# Altium schematic sheet 13.SchDoc
size 513 x 386 mm
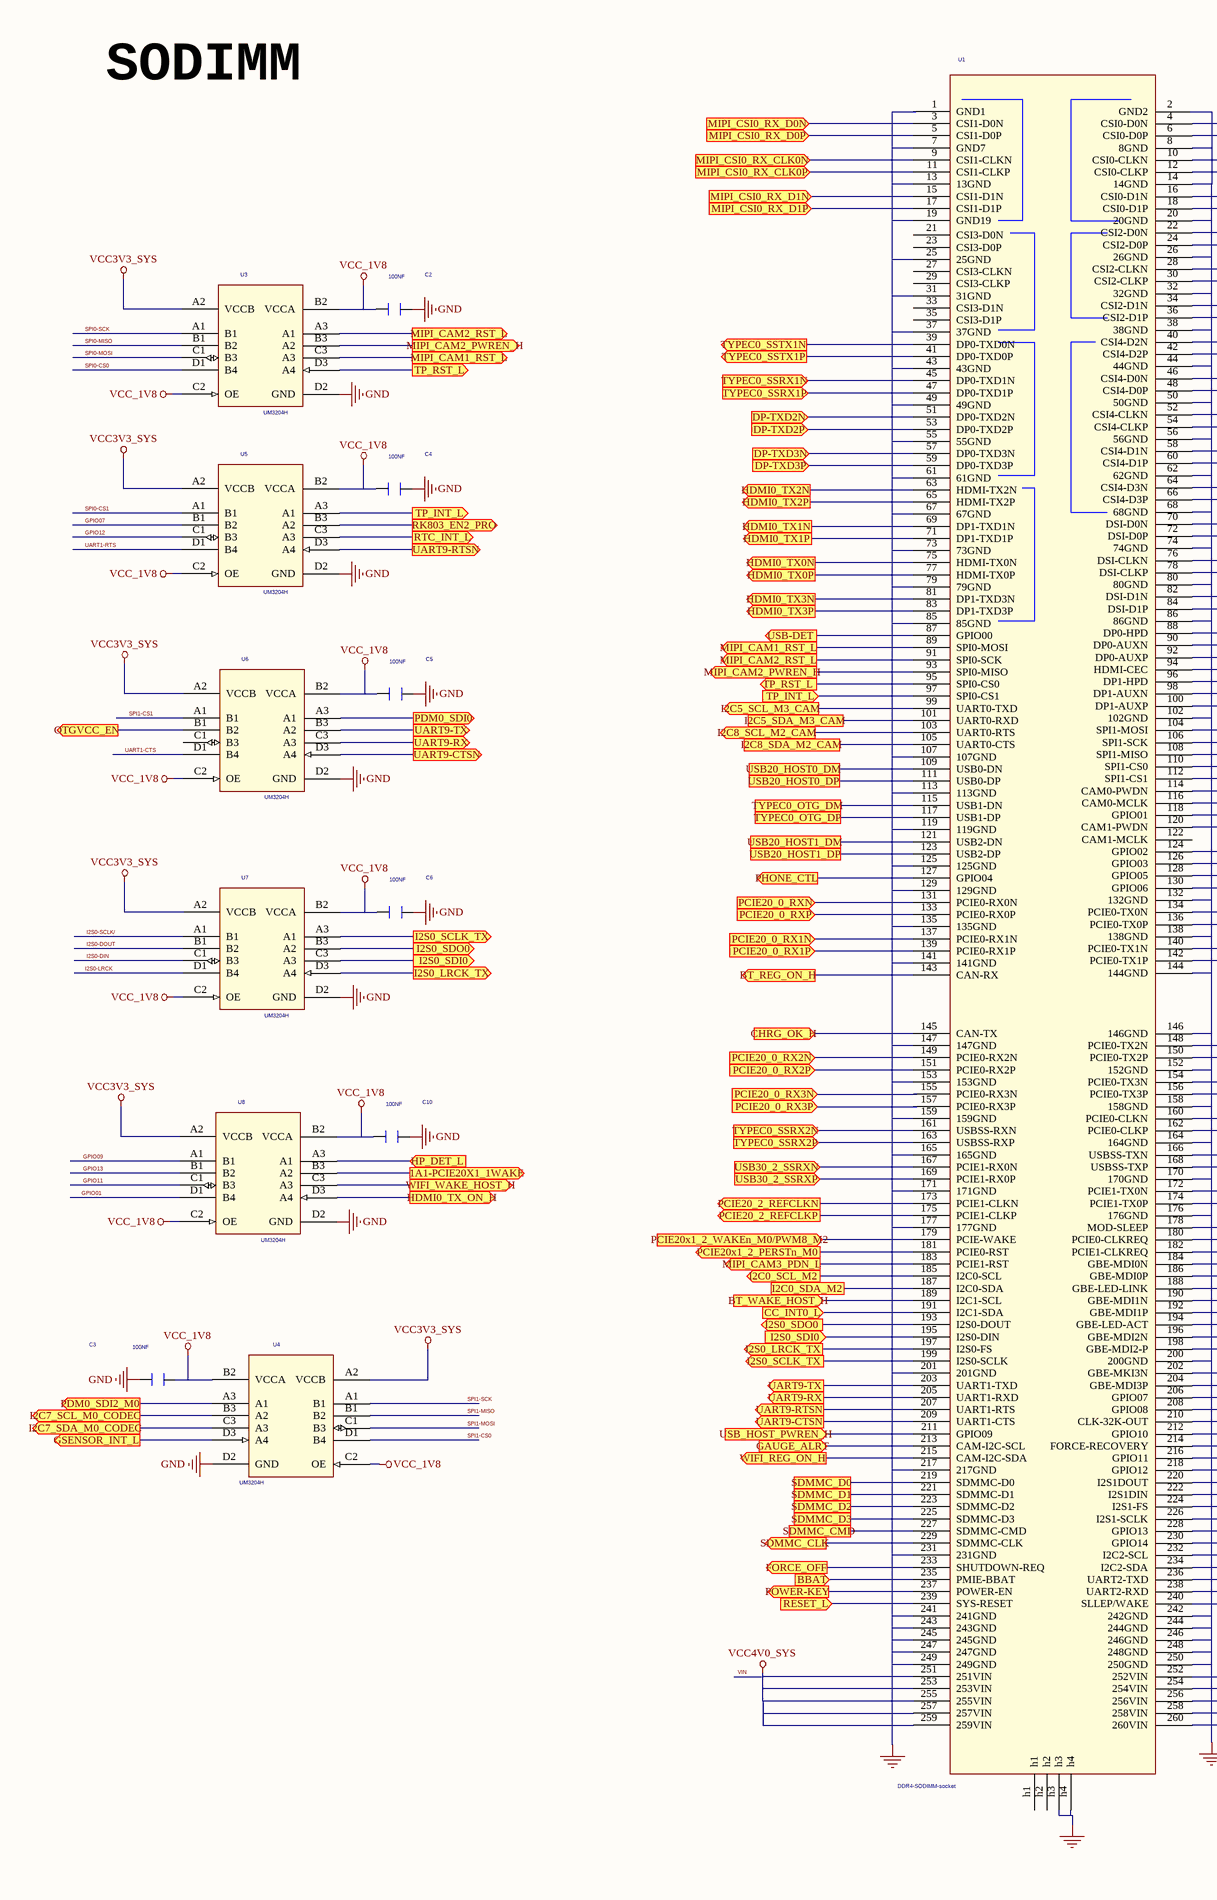
[diagram p0: 13.SchDoc, left]
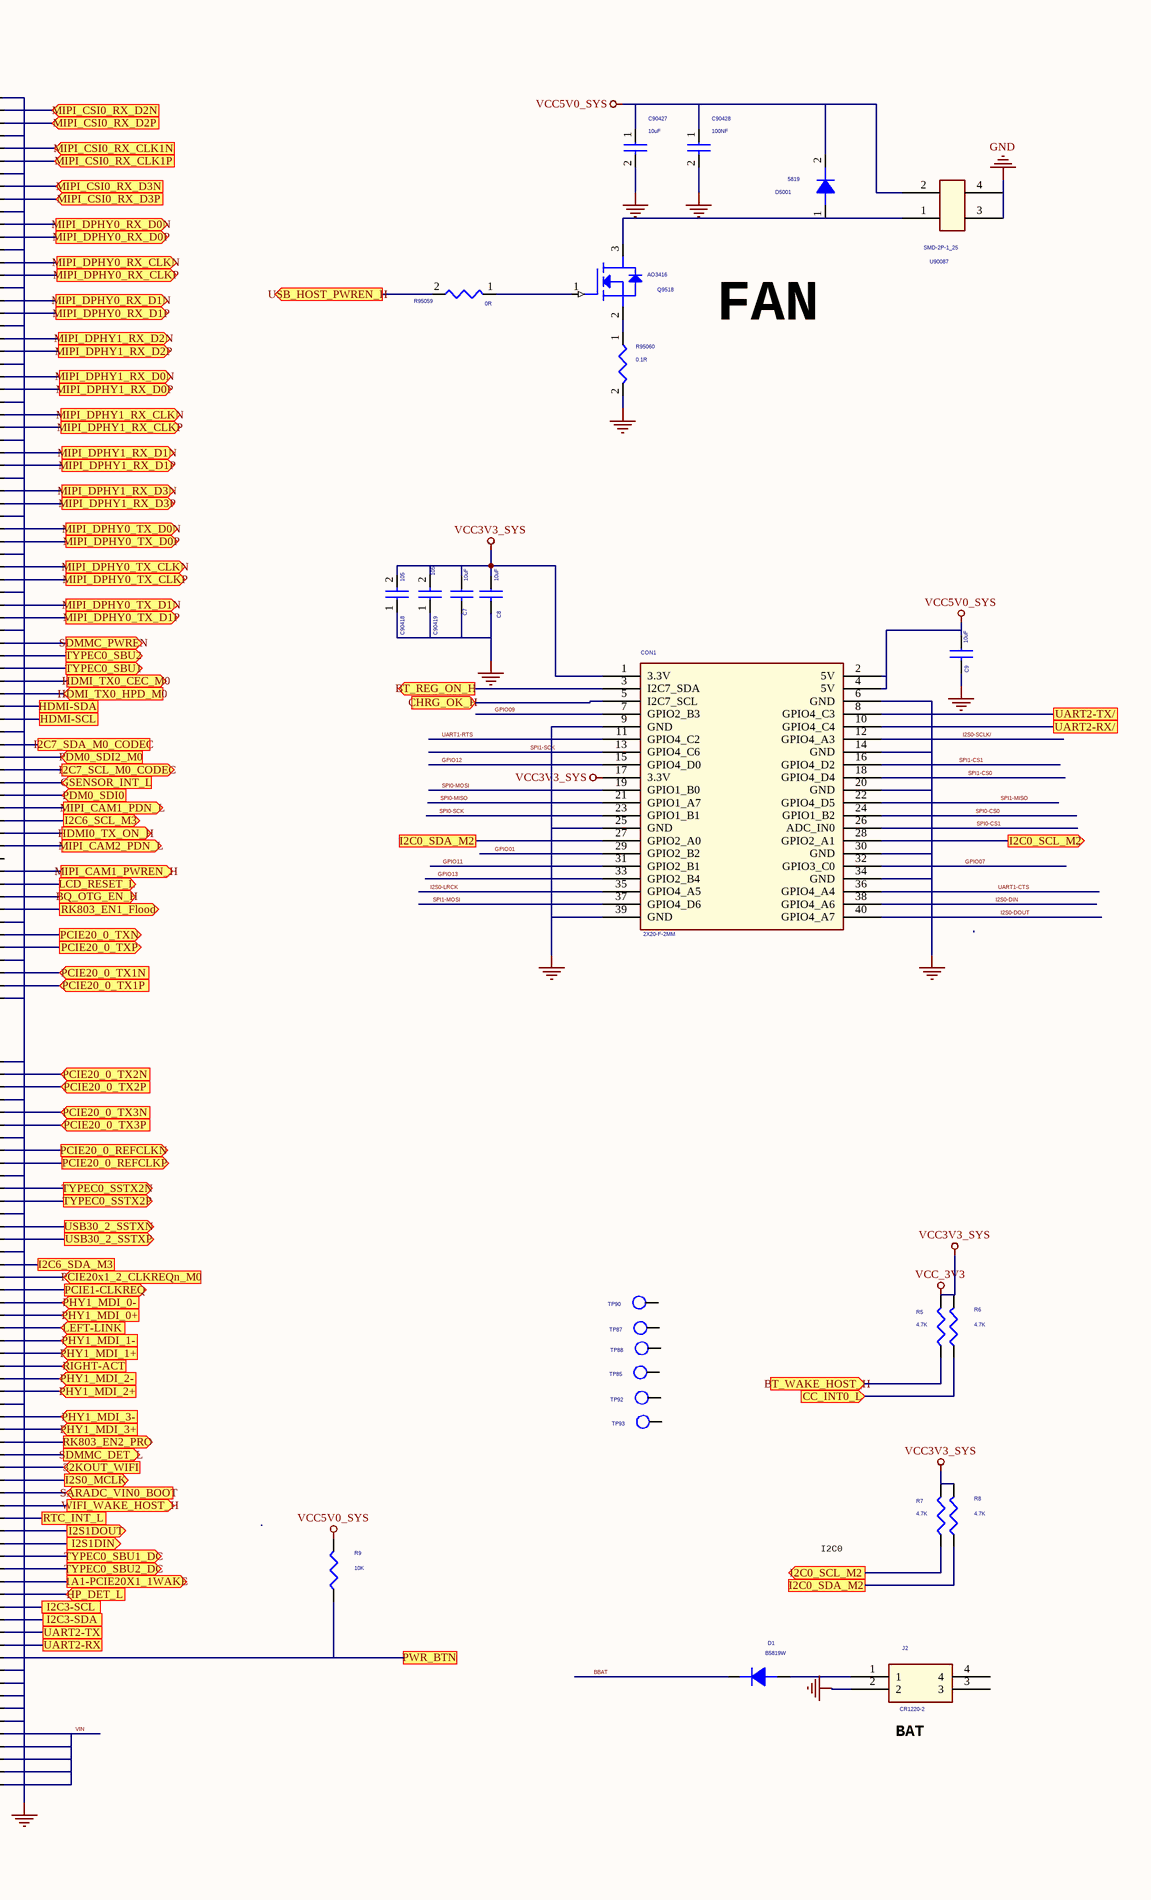
[diagram p1: 13.SchDoc, right]

## Parts
C2  100NF  [C0402]
C3  100NF  [C0402]
C4  100NF  [C0402]
C5  100NF  [C0402]
C6  100NF  [C0402]
C7  10uF  [C0603]
C8  10uF  [C0603]
C9  10uF  [C0603]
C10  100NF  [C0402]
C90418  105  [C0402]
C90419  105  [C0402]
C90427  10uF  [C1206]
C90428  100NF  [C0402]
CON1  2X20-F-2MM  [DIP40PIN-2.54MM_FX]
D1  B5819W  [SOD_123]
D5001  5819  [SOD_123]
J2  CR1220-2  [CR1220-2]
Q9518  AO3416  [SOT23]
R5  4.7K  [R0402]
R6  4.7K  [R0402]
R7  4.7K  [R0402]
R8  4.7K  [R0402]
R9  10K  [R0402]
R95059  0R  [R0402]
R95060  0.1R  [R0402]
TP85  TP  [tp1-8040]  (value not drawn)
TP87  TP  [tp1-8040]  (value not drawn)
TP88  TP  [tp1-8040]  (value not drawn)
TP90  TP  [tp1-8040]  (value not drawn)
TP92  TP  [tp1-8040]  (value not drawn)
TP93  TP  [tp1-8040]  (value not drawn)
U1  DDR4-SODIMM-socket  [DDR4-SODIMM-socket]
U3  UM3204H  [CSP-12]
U4  UM3204H  [CSP-12]
U5  UM3204H  [CSP-12]
U6  UM3204H  [CSP-12]
U7  UM3204H  [CSP-12]
U8  UM3204H  [CSP-12]
U90087  SMD-2P-1_25  [SMD-2P-1_25]

## Ports
1A1-PCIE20X1_1WAKE (out), 32KOUT_WIFI (in), BBAT (in), BQ_OTG_EN_H (out), BT_REG_ON_H (out), BT_WAKE_HOST_H (in), CC_INT0_L (in), CHRG_OK_H (in), DP-TXD2N (in), DP-TXD2P (in), DP-TXD3N (in), DP-TXD3P (in), FORCE_OFF (out), GAUGE_ALRT (in), GSENSOR_INT_L (in), GSENSOR_INT_L (out), HDMI0_TX0N (out), HDMI0_TX0P (out), HDMI0_TX1N (out), HDMI0_TX1P (out), HDMI0_TX2N (out), HDMI0_TX2P (out), HDMI0_TX3N (out), HDMI0_TX3P (out), HDMI0_TX_ON_H (out), HDMI-SCL, HDMI-SDA, HDMI_TX0_CEC_M0 (out), HDMI_TX0_HPD_M0 (in), HP_DET_L (in), I2C0_SCL_M2 (out), I2C0_SDA_M2, I2C3-SCL, I2C3-SDA, I2C5_SCL_M3_CAM (out), I2C5_SDA_M3_CAM, I2C6_SCL_M3 (out), I2C6_SDA_M3, I2C7_SCL_M0_CODEC (out), I2C7_SDA_M0_CODEC, I2C7_SDA_M0_CODEC (out), I2C8_SCL_M2_CAM (out), I2C8_SDA_M2_CAM, I2S0_LRCK_TX (out), I2S0_MCLK (out), I2S0_SCLK_TX (out), I2S0_SDI0 (in), I2S0_SDI0 (out), I2S0_SDO0 (out), I2S1DIN (out), I2S1DOUT (out), LCD_RESET_L (out), LEFT-LINK (in), MIPI_CAM1_PDN_L (out), MIPI_CAM1_PWREN_H (out), MIPI_CAM1_RST_L (out), MIPI_CAM2_PDN_L (out), MIPI_CAM2_PWREN_H (out), MIPI_CAM2_RST_L (out), MIPI_CAM3_PDN_L (out), MIPI_CSI0_RX_CLK0N (in), MIPI_CSI0_RX_CLK0P (in), MIPI_CSI0_RX_CLK1N (in), MIPI_CSI0_RX_CLK1P (in), MIPI_CSI0_RX_D0N (in), MIPI_CSI0_RX_D0P (in), MIPI_CSI0_RX_D1N (in), MIPI_CSI0_RX_D1P (in), MIPI_CSI0_RX_D2N (in), MIPI_CSI0_RX_D2P (in), MIPI_CSI0_RX_D3N (in), MIPI_CSI0_RX_D3P (in), MIPI_DPHY0_RX_CLKN (out), MIPI_DPHY0_RX_CLKP (out), MIPI_DPHY0_RX_D0N (out), MIPI_DPHY0_RX_D0P (out), MIPI_DPHY0_RX_D1N (out), MIPI_DPHY0_RX_D1P (out), MIPI_DPHY0_TX_CLKN (out), MIPI_DPHY0_TX_CLKP (out), MIPI_DPHY0_TX_D0N (out), MIPI_DPHY0_TX_D0P (out), MIPI_DPHY0_TX_D1N (out), MIPI_DPHY0_TX_D1P (out), MIPI_DPHY1_RX_CLKN (out), MIPI_DPHY1_RX_CLKP (out), MIPI_DPHY1_RX_D0N (out), MIPI_DPHY1_RX_D0P (out), MIPI_DPHY1_RX_D1N (out), MIPI_DPHY1_RX_D1P (out), MIPI_DPHY1_RX_D2N (out), MIPI_DPHY1_RX_D2P (out), MIPI_DPHY1_RX_D3N (out), MIPI_DPHY1_RX_D3P (out), OTGVCC_EN (out), PCIE1-CLKREQ (out), PCIE20_0_REFCLKN (out), PCIE20_0_REFCLKP (out), PCIE20_0_RX1N (in), PCIE20_0_RX1P (in), PCIE20_0_RX2N (in), PCIE20_0_RX2P (in), PCIE20_0_RX3N (in), PCIE20_0_RX3P (in), PCIE20_0_RXN (in), PCIE20_0_RXP (in), PCIE20_0_TX1N (in), PCIE20_0_TX1P (in), PCIE20_0_TX2N (in), PCIE20_0_TX2P (in), PCIE20_0_TX3N (in), PCIE20_0_TX3P (in), PCIE20_0_TXN (out), PCIE20_0_TXP (out), PCIE20_2_REFCLKN (out), PCIE20_2_REFCLKP (out), PCIE20x1_2_CLKREQn_M0 (in), PCIE20x1_2_PERSTn_M0 (out), PCIE20x1_2_WAKEn_M0/PWM8_M2 (in), PDM0_SDI0 (in), PDM0_SDI0 (out), PDM0_SDI2_M0 (in), PDM0_SDI2_M0 (out), PHONE_CTL (out), PHY1_MDI_0+ (in), PHY1_MDI_0- (in), PHY1_MDI_1+ (in), PHY1_MDI_1- (in), PHY1_MDI_2+ (in), PHY1_MDI_2- (in), PHY1_MDI_3+ (in), PHY1_MDI_3- (in), POWER-KEY (out), PWR_BTN, RESET_L (in), RIGHT-ACT (in), RK803_EN1_Flood (out), RK803_EN2_PRO (out), RTC_INT_L, RTC_INT_L (out), SARADC_VIN0_BOOT (in), SDMMC_CLK (out), SDMMC_CMD, SDMMC_D0, SDMMC_D1, SDMMC_D2, SDMMC_D3, SDMMC_DET_L (out), SDMMC_PWREN (out), TP_INT_L (in), TP_INT_L (out), TP_RST_L (out), TYPEC0_OTG_DM, TYPEC0_OTG_DP, TYPEC0_SBU1 (out), TYPEC0_SBU1_DC (out), TYPEC0_SBU2 (out), TYPEC0_SBU2_DC (out), TYPEC0_SSRX1N (in), TYPEC0_SSRX1P (in), TYPEC0_SSRX2N (in), TYPEC0_SSRX2P (in), TYPEC0_SSTX1N (out), TYPEC0_SSTX1P (out), TYPEC0_SSTX2N (out), TYPEC0_SSTX2P (out), UART2-RX, UART2-RX/, UART2-TX, UART2-TX/, UART9-CTSN (out), UART9-RTSN (out), UART9-RX (out), UART9-TX (out), USB20_HOST0_DM, USB20_HOST0_DP, USB20_HOST1_DM, USB20_HOST1_DP, USB30_2_SSRXN (in), USB30_2_SSRXP (in), USB30_2_SSTXN (out), USB30_2_SSTXP (out), USB-DET (out), USB_HOST_PWREN_H (in), USB_HOST_PWREN_H (out), WIFI_REG_ON_H (out), WIFI_WAKE_HOST_H (out)

## Nets
GND: C2.1 C3.1 C4.1 C5.1 C6.1 C7.2 C8.2 C9.2 C10.1 C90418.1 C90419.1 C90427.2 C90428.2 CON1.6(GND) CON1.9(GND) CON1.14(GND) CON1.20(GND) CON1.25(GND) CON1.30(GND) CON1.34(GND) CON1.39(GND) J2.2 R95060.2 U1.1(GND1) U1.2(GND2) U1.7(GND7) U1.8(8GND) U1.13(13GND) U1.14(14GND) U1.19(GND19) U1.20(20GND) U1.25(25GND) U1.26(26GND) U1.31(31GND) U1.32(32GND) U1.37(37GND) U1.38(38GND) U1.43(43GND) U1.44(44GND) U1.49(49GND) U1.50(50GND) U1.55(55GND) U1.56(56GND) U1.61(61GND) U1.62(62GND) U1.67(67GND) U1.68(68GND) U1.73(73GND) U1.74(74GND) U1.79(79GND) U1.80(80GND) U1.85(85GND) U1.86(86GND) U1.102(102GND) U1.107(107GND) U1.113(113GND) U1.119(119GND) U1.125(125GND) U1.129(129GND) U1.132(132GND) U1.135(135GND) U1.138(138GND) U1.141(141GND) U1.144(144GND) U1.146(146GND) U1.147(147GND) U1.152(152GND) U1.153(153GND) U1.158(158GND) U1.159(159GND) U1.164(164GND) U1.165(165GND) U1.170(170GND) U1.171(171GND) U1.176(176GND) U1.177(177GND) U1.200(200GND) U1.201(201GND) U1.217(217GND) U1.231(231GND) U1.241(241GND) U1.242(242GND) U1.243(243GND) U1.244(244GND) U1.245(245GND) U1.246(246GND) U1.247(247GND) U1.248(248GND) U1.249(249GND) U1.250(250GND) U1.h3 U1.h4 U3.D2(GND) U4.D2(GND) U5.D2(GND) U6.D2(GND) U7.D2(GND) U8.D2(GND) U90087.3 U90087.4
VCC3V3_SYS: C7.1 C8.1 C90418.2 C90419.2 CON1.1(3.3V) CON1.17(3.3V) R5.2 R6.2 R7.2 R8.2 U3.A2(VCCB) U4.A2(VCCB) U5.A2(VCCB) U6.A2(VCCB) U7.A2(VCCB) U8.A2(VCCB)  [also labelled VCC_3V3]
VCC4V0_SYS: U1.251(251VIN) U1.253(253VIN) U1.255(255VIN) U1.257(257VIN) U1.259(259VIN)
VCC5V0_SYS: C9.1 C90427.1 C90428.1 CON1.2(5V) CON1.4(5V) D5001.2(K) R9.2 U90087.2
VCC_1V8: C2.2 C3.2 C4.2 C5.2 C6.2 C10.2 U3.B2(VCCA) U3.C2(OE) U4.B2(VCCA) U4.C2(OE) U5.B2(VCCA) U5.C2(OE) U6.B2(VCCA) U6.C2(OE) U7.B2(VCCA) U7.C2(OE) U8.B2(VCCA) U8.C2(OE)
1A1-PCIE20X1_1WAKE: U1.228(GPIO13) U8.B3(A2) ; port 1A1-PCIE20X1_1WAKE
32KOUT_WIFI: U1.210(CLK-32K-OUT) ; port 32KOUT_WIFI
BBAT: U1.235(PMIE-BBAT) ; port BBAT
BBAT: D1.2(K)  [a separate net that carries the same name]
BQ_OTG_EN_H: U1.128(GPIO05) ; port BQ_OTG_EN_H
BT_REG_ON_H: CON1.3(I2C7_SDA) U1.143(CAN-RX) ; port BT_REG_ON_H
BT_WAKE_HOST_H: R5.1 U1.189(I2C1-SCL) ; port BT_WAKE_HOST_H
CC_INT0_L: R6.1 U1.191(I2C1-SDA) ; port CC_INT0_L
CHRG_OK_H: CON1.5(I2C7_SCL) U1.145(CAN-TX) ; port CHRG_OK_H
DP-TXD2N: U1.51(DP0-TXD2N) ; port DP-TXD2N
DP-TXD2P: U1.53(DP0-TXD2P) ; port DP-TXD2P
DP-TXD3N: U1.57(DP0-TXD3N) ; port DP-TXD3N
DP-TXD3P: U1.59(DP0-TXD3P) ; port DP-TXD3P
FORCE_OFF: U1.233(SHUTDOWN-REQ) ; port FORCE_OFF
GAUGE_ALRT: U1.213(CAM-I2C-SCL) ; port GAUGE_ALRT
GPIO01: CON1.29(GPIO2_B2) U8.D1(B4)
GPIO07: CON1.32(GPIO3_C0) U5.B1(B2)
GPIO09: CON1.7(GPIO2_B3) U8.A1(B1)
GPIO11: CON1.31(GPIO2_B1) U8.C1(B3)
GPIO12: CON1.15(GPIO4_D0) U5.C1(B3)
GPIO13: CON1.33(GPIO2_B4) U8.B1(B2)
GSENSOR_INT_L: U1.110(SPI1-CS0) U4.D3(A4) ; port GSENSOR_INT_L
HDMI0_TX0N: U1.75(HDMI-TX0N) ; port HDMI0_TX0N
HDMI0_TX0P: U1.77(HDMI-TX0P) ; port HDMI0_TX0P
HDMI0_TX1N: U1.69(DP1-TXD1N) ; port HDMI0_TX1N
HDMI0_TX1P: U1.71(DP1-TXD1P) ; port HDMI0_TX1P
HDMI0_TX2N: U1.63(HDMI-TX2N) ; port HDMI0_TX2N
HDMI0_TX2P: U1.65(HDMI-TX2P) ; port HDMI0_TX2P
HDMI0_TX3N: U1.81(DP1-TXD3N) ; port HDMI0_TX3N
HDMI0_TX3P: U1.83(DP1-TXD3P) ; port HDMI0_TX3P
HDMI0_TX_ON_H: U1.118(GPIO01) U8.D3(A4) ; port HDMI0_TX_ON_H
HDMI-SCL: U1.100(DP1-AUXP) ; port HDMI-SCL
HDMI-SDA: U1.98(DP1-AUXN) ; port HDMI-SDA
HDMI_TX0_CEC_M0: U1.94(HDMI-CEC) ; port HDMI_TX0_CEC_M0
HDMI_TX0_HPD_M0: U1.96(DP1-HPD) ; port HDMI_TX0_HPD_M0
HP_DET_L: U1.230(GPIO14) U8.A3(A1) ; port HP_DET_L
I2C0_SCL_M2: CON1.28(GPIO2_A1) R7.1 U1.185(I2C0-SCL) ; port I2C0_SCL_M2
I2C0_SDA_M2: CON1.27(GPIO2_A0) R8.1 U1.187(I2C0-SDA) ; port I2C0_SDA_M2
I2C3-SCL: U1.232(I2C2-SCL) ; port I2C3-SCL
I2C3-SDA: U1.234(I2C2-SDA) ; port I2C3-SDA
I2C5_SCL_M3_CAM: U1.99(UART0-TXD) ; port I2C5_SCL_M3_CAM
I2C5_SDA_M3_CAM: U1.101(UART0-RXD) ; port I2C5_SDA_M3_CAM
I2C6_SCL_M3: U1.116(CAM0-MCLK) ; port I2C6_SCL_M3
I2C6_SDA_M3: U1.178(MOD-SLEEP) ; port I2C6_SDA_M3
I2C7_SCL_M0_CODEC: U1.108(SPI1-MISO) U4.B3(A2) ; port I2C7_SCL_M0_CODEC
I2C7_SDA_M0_CODEC: U1.104(SPI1-MOSI) U4.C3(A3) ; port I2C7_SDA_M0_CODEC
I2C8_SCL_M2_CAM: U1.103(UART0-RTS) ; port I2C8_SCL_M2_CAM
I2C8_SDA_M2_CAM: U1.105(UART0-CTS) ; port I2C8_SDA_M2_CAM
I2S0-DIN: CON1.38(GPIO4_A6) U7.C1(B3)
I2S0-DOUT: CON1.40(GPIO4_A7) U7.B1(B2)
I2S0-LRCK: CON1.35(GPIO4_A5) U7.D1(B4)
I2S0-SCLK/: CON1.12(GPIO4_A3) U7.A1(B1)
I2S0_LRCK_TX: U1.197(I2S0-FS) U7.D3(A4) ; port I2S0_LRCK_TX
I2S0_MCLK: U1.212(GPIO10) ; port I2S0_MCLK
I2S0_SCLK_TX: U1.199(I2S0-SCLK) U7.A3(A1) ; port I2S0_SCLK_TX
I2S0_SDI0: U1.195(I2S0-DIN) U7.C3(A3) ; port I2S0_SDI0
I2S0_SDO0: U1.193(I2S0-DOUT) U7.B3(A2) ; port I2S0_SDO0
I2S1DIN: U1.222(I2S1DIN) ; port I2S1DIN
I2S1DOUT: U1.220(I2S1DOUT) ; port I2S1DOUT
LCD_RESET_L: U1.126(GPIO03) ; port LCD_RESET_L
LEFT-LINK: U1.188(GBE-LED-LINK) ; port LEFT-LINK
MIPI_CAM1_PDN_L: U1.114(CAM0-PWDN) ; port MIPI_CAM1_PDN_L
MIPI_CAM1_PWREN_H: U1.124(GPIO02) ; port MIPI_CAM1_PWREN_H
MIPI_CAM1_RST_L: U1.89(SPI0-MOSI) U3.C3(A3) ; port MIPI_CAM1_RST_L
MIPI_CAM2_PDN_L: U1.120(CAM1-PWDN) ; port MIPI_CAM2_PDN_L
MIPI_CAM2_PWREN_H: U1.93(SPI0-MISO) U3.B3(A2) ; port MIPI_CAM2_PWREN_H
MIPI_CAM2_RST_L: U1.91(SPI0-SCK) U3.A3(A1) ; port MIPI_CAM2_RST_L
MIPI_CAM3_PDN_L: U1.183(PCIE1-RST) ; port MIPI_CAM3_PDN_L
MIPI_CSI0_RX_CLK0N: U1.9(CSI1-CLKN) ; port MIPI_CSI0_RX_CLK0N
MIPI_CSI0_RX_CLK0P: U1.11(CSI1-CLKP) ; port MIPI_CSI0_RX_CLK0P
MIPI_CSI0_RX_CLK1N: U1.10(CSI0-CLKN) ; port MIPI_CSI0_RX_CLK1N
MIPI_CSI0_RX_CLK1P: U1.12(CSI0-CLKP) ; port MIPI_CSI0_RX_CLK1P
MIPI_CSI0_RX_D0N: U1.3(CSI1-D0N) ; port MIPI_CSI0_RX_D0N
MIPI_CSI0_RX_D0P: U1.5(CSI1-D0P) ; port MIPI_CSI0_RX_D0P
MIPI_CSI0_RX_D1N: U1.15(CSI1-D1N) ; port MIPI_CSI0_RX_D1N
MIPI_CSI0_RX_D1P: U1.17(CSI1-D1P) ; port MIPI_CSI0_RX_D1P
MIPI_CSI0_RX_D2N: U1.4(CSI0-D0N) ; port MIPI_CSI0_RX_D2N
MIPI_CSI0_RX_D2P: U1.6(CSI0-D0P) ; port MIPI_CSI0_RX_D2P
MIPI_CSI0_RX_D3N: U1.16(CSI0-D1N) ; port MIPI_CSI0_RX_D3N
MIPI_CSI0_RX_D3P: U1.18(CSI0-D1P) ; port MIPI_CSI0_RX_D3P
MIPI_DPHY0_RX_CLKN: U1.28(CSI2-CLKN) ; port MIPI_DPHY0_RX_CLKN
MIPI_DPHY0_RX_CLKP: U1.30(CSI2-CLKP) ; port MIPI_DPHY0_RX_CLKP
MIPI_DPHY0_RX_D0N: U1.22(CSI2-D0N) ; port MIPI_DPHY0_RX_D0N
MIPI_DPHY0_RX_D0P: U1.24(CSI2-D0P) ; port MIPI_DPHY0_RX_D0P
MIPI_DPHY0_RX_D1N: U1.34(CSI2-D1N) ; port MIPI_DPHY0_RX_D1N
MIPI_DPHY0_RX_D1P: U1.36(CSI2-D1P) ; port MIPI_DPHY0_RX_D1P
MIPI_DPHY0_TX_CLKN: U1.76(DSI-CLKN) ; port MIPI_DPHY0_TX_CLKN
MIPI_DPHY0_TX_CLKP: U1.78(DSI-CLKP) ; port MIPI_DPHY0_TX_CLKP
MIPI_DPHY0_TX_D0N: U1.70(DSI-D0N) ; port MIPI_DPHY0_TX_D0N
MIPI_DPHY0_TX_D0P: U1.72(DSI-D0P) ; port MIPI_DPHY0_TX_D0P
MIPI_DPHY0_TX_D1N: U1.82(DSI-D1N) ; port MIPI_DPHY0_TX_D1N
MIPI_DPHY0_TX_D1P: U1.84(DSI-D1P) ; port MIPI_DPHY0_TX_D1P
MIPI_DPHY1_RX_CLKN: U1.52(CSI4-CLKN) ; port MIPI_DPHY1_RX_CLKN
MIPI_DPHY1_RX_CLKP: U1.54(CSI4-CLKP) ; port MIPI_DPHY1_RX_CLKP
MIPI_DPHY1_RX_D0N: U1.46(CSI4-D0N) ; port MIPI_DPHY1_RX_D0N
MIPI_DPHY1_RX_D0P: U1.48(CSI4-D0P) ; port MIPI_DPHY1_RX_D0P
MIPI_DPHY1_RX_D1N: U1.58(CSI4-D1N) ; port MIPI_DPHY1_RX_D1N
MIPI_DPHY1_RX_D1P: U1.60(CSI4-D1P) ; port MIPI_DPHY1_RX_D1P
MIPI_DPHY1_RX_D2N: U1.40(CSI4-D2N) ; port MIPI_DPHY1_RX_D2N
MIPI_DPHY1_RX_D2P: U1.42(CSI4-D2P) ; port MIPI_DPHY1_RX_D2P
MIPI_DPHY1_RX_D3N: U1.64(CSI4-D3N) ; port MIPI_DPHY1_RX_D3N
MIPI_DPHY1_RX_D3P: U1.66(CSI4-D3P) ; port MIPI_DPHY1_RX_D3P
OTGVCC_EN: U6.B1(B2) ; port OTGVCC_EN
PCIE1-CLKREQ: U1.182(PCIE1-CLKREQ) ; port PCIE1-CLKREQ
PCIE20_0_REFCLKN: U1.160(PCIE0-CLKN) ; port PCIE20_0_REFCLKN
PCIE20_0_REFCLKP: U1.162(PCIE0-CLKP) ; port PCIE20_0_REFCLKP
PCIE20_0_RX1N: U1.137(PCIE0-RX1N) ; port PCIE20_0_RX1N
PCIE20_0_RX1P: U1.139(PCIE0-RX1P) ; port PCIE20_0_RX1P
PCIE20_0_RX2N: U1.149(PCIE0-RX2N) ; port PCIE20_0_RX2N
PCIE20_0_RX2P: U1.151(PCIE0-RX2P) ; port PCIE20_0_RX2P
PCIE20_0_RX3N: U1.155(PCIE0-RX3N) ; port PCIE20_0_RX3N
PCIE20_0_RX3P: U1.157(PCIE0-RX3P) ; port PCIE20_0_RX3P
PCIE20_0_RXN: U1.131(PCIE0-RX0N) ; port PCIE20_0_RXN
PCIE20_0_RXP: U1.133(PCIE0-RX0P) ; port PCIE20_0_RXP
PCIE20_0_TX1N: U1.140(PCIE0-TX1N) ; port PCIE20_0_TX1N
PCIE20_0_TX1P: U1.142(PCIE0-TX1P) ; port PCIE20_0_TX1P
PCIE20_0_TX2N: U1.148(PCIE0-TX2N) ; port PCIE20_0_TX2N
PCIE20_0_TX2P: U1.150(PCIE0-TX2P) ; port PCIE20_0_TX2P
PCIE20_0_TX3N: U1.154(PCIE0-TX3N) ; port PCIE20_0_TX3N
PCIE20_0_TX3P: U1.156(PCIE0-TX3P) ; port PCIE20_0_TX3P
PCIE20_0_TXN: U1.134(PCIE0-TX0N) ; port PCIE20_0_TXN
PCIE20_0_TXP: U1.136(PCIE0-TX0P) ; port PCIE20_0_TXP
PCIE20_2_REFCLKN: U1.173(PCIE1-CLKN) ; port PCIE20_2_REFCLKN
PCIE20_2_REFCLKP: U1.175(PCIE1-CLKP) ; port PCIE20_2_REFCLKP
PCIE20x1_2_CLKREQn_M0: U1.180(PCIE0-CLKREQ) ; port PCIE20x1_2_CLKREQn_M0
PCIE20x1_2_PERSTn_M0: U1.181(PCIE0-RST) ; port PCIE20x1_2_PERSTn_M0
PCIE20x1_2_WAKEn_M0/PWM8_M2: U1.179(PCIE-WAKE) ; port PCIE20x1_2_WAKEn_M0/PWM8_M2
PDM0_SDI0: U1.112(SPI1-CS1) U6.A3(A1) ; port PDM0_SDI0
PDM0_SDI2_M0: U1.106(SPI1-SCK) U4.A3(A1) ; port PDM0_SDI2_M0
PHONE_CTL: U1.127(GPIO04) ; port PHONE_CTL
PHY1_MDI_0+: U1.186(GBE-MDI0P) ; port PHY1_MDI_0+
PHY1_MDI_0-: U1.184(GBE-MDI0N) ; port PHY1_MDI_0-
PHY1_MDI_1+: U1.192(GBE-MDI1P) ; port PHY1_MDI_1+
PHY1_MDI_1-: U1.190(GBE-MDI1N) ; port PHY1_MDI_1-
PHY1_MDI_2+: U1.198(GBE-MDI2-P) ; port PHY1_MDI_2+
PHY1_MDI_2-: U1.196(GBE-MDI2N) ; port PHY1_MDI_2-
PHY1_MDI_3+: U1.204(GBE-MDI3P) ; port PHY1_MDI_3+
PHY1_MDI_3-: U1.202(GBE-MKI3N) ; port PHY1_MDI_3-
POWER-KEY: U1.237(POWER-EN) ; port POWER-KEY
PWR_BTN: R9.1 U1.240(SLLEP/WAKE) ; port PWR_BTN
RESET_L: U1.239(SYS-RESET) ; port RESET_L
RIGHT-ACT: U1.194(GBE-LED-ACT) ; port RIGHT-ACT
RK803_EN1_Flood: U1.130(GPIO06) ; port RK803_EN1_Flood
RK803_EN2_PRO: U1.206(GPIO07) U5.B3(A2) ; port RK803_EN2_PRO
RTC_INT_L: U1.218(GPIO12) U5.C3(A3) ; port RTC_INT_L
SARADC_VIN0_BOOT: U1.214(FORCE-RECOVERY) ; port SARADC_VIN0_BOOT
SDMMC_CLK: U1.229(SDMMC-CLK) ; port SDMMC_CLK
SDMMC_CMD: U1.227(SDMMC-CMD) ; port SDMMC_CMD
SDMMC_D0: U1.219(SDMMC-D0) ; port SDMMC_D0
SDMMC_D1: U1.221(SDMMC-D1) ; port SDMMC_D1
SDMMC_D2: U1.223(SDMMC-D2) ; port SDMMC_D2
SDMMC_D3: U1.225(SDMMC-D3) ; port SDMMC_D3
SDMMC_DET_L: U1.208(GPIO08) ; port SDMMC_DET_L
SDMMC_PWREN: U1.88(DP0-HPD) ; port SDMMC_PWREN
SPI0-CS0: CON1.24(GPIO1_B2) U3.D1(B4)
SPI0-CS1: CON1.26(ADC_IN0) U5.A1(B1)
SPI0-MISO: CON1.21(GPIO1_A7) U3.B1(B2)
SPI0-MOSI: CON1.19(GPIO1_B0) U3.C1(B3)
SPI0-SCK: CON1.23(GPIO1_B1) U3.A1(B1)
SPI1-CS0: CON1.18(GPIO4_D4) U4.D1(B4)
SPI1-CS1: CON1.16(GPIO4_D2) U6.A1(B1)
SPI1-MISO: CON1.22(GPIO4_D5) U4.B1(B2)
SPI1-MOSI: CON1.37(GPIO4_D6) U4.C1(B3)
SPI1-SCK: CON1.13(GPIO4_C6) U4.A1(B1)
TP_INT_L: U1.97(SPI0-CS1) U5.A3(A1) ; port TP_INT_L
TP_RST_L: U1.95(SPI0-CS0) U3.D3(A4) ; port TP_RST_L
TYPEC0_OTG_DM: U1.115(USB1-DN) ; port TYPEC0_OTG_DM
TYPEC0_OTG_DP: U1.117(USB1-DP) ; port TYPEC0_OTG_DP
TYPEC0_SBU1: U1.92(DP0-AUXP) ; port TYPEC0_SBU1
TYPEC0_SBU1_DC: U1.224(I2S1-FS) ; port TYPEC0_SBU1_DC
TYPEC0_SBU2: U1.90(DP0-AUXN) ; port TYPEC0_SBU2
TYPEC0_SBU2_DC: U1.226(I2S1-SCLK) ; port TYPEC0_SBU2_DC
TYPEC0_SSRX1N: U1.45(DP0-TXD1N) ; port TYPEC0_SSRX1N
TYPEC0_SSRX1P: U1.47(DP0-TXD1P) ; port TYPEC0_SSRX1P
TYPEC0_SSRX2N: U1.161(USBSS-RXN) ; port TYPEC0_SSRX2N
TYPEC0_SSRX2P: U1.163(USBSS-RXP) ; port TYPEC0_SSRX2P
TYPEC0_SSTX1N: U1.39(DP0-TXD0N) ; port TYPEC0_SSTX1N
TYPEC0_SSTX1P: U1.41(DP0-TXD0P) ; port TYPEC0_SSTX1P
TYPEC0_SSTX2N: U1.166(USBSS-TXN) ; port TYPEC0_SSTX2N
TYPEC0_SSTX2P: U1.168(USBSS-TXP) ; port TYPEC0_SSTX2P
UART1-CTS: CON1.36(GPIO4_A4) U6.D1(B4)
UART1-RTS: CON1.11(GPIO4_C2) U5.D1(B4)
UART2-RX: U1.238(UART2-RXD) ; port UART2-RX
UART2-RX/: CON1.10(GPIO4_C4) ; port UART2-RX/
UART2-TX: U1.236(UART2-TXD) ; port UART2-TX
UART2-TX/: CON1.8(GPIO4_C3) ; port UART2-TX/
UART9-CTSN: U1.209(UART1-CTS) U6.D3(A4) ; port UART9-CTSN
UART9-RTSN: U1.207(UART1-RTS) U5.D3(A4) ; port UART9-RTSN
UART9-RX: U1.205(UART1-RXD) U6.C3(A3) ; port UART9-RX
UART9-TX: U1.203(UART1-TXD) U6.B3(A2) ; port UART9-TX
USB20_HOST0_DM: U1.109(USB0-DN) ; port USB20_HOST0_DM
USB20_HOST0_DP: U1.111(USB0-DP) ; port USB20_HOST0_DP
USB20_HOST1_DM: U1.121(USB2-DN) ; port USB20_HOST1_DM
USB20_HOST1_DP: U1.123(USB2-DP) ; port USB20_HOST1_DP
USB30_2_SSRXN: U1.167(PCIE1-RX0N) ; port USB30_2_SSRXN
USB30_2_SSRXP: U1.169(PCIE1-RX0P) ; port USB30_2_SSRXP
USB30_2_SSTXN: U1.172(PCIE1-TX0N) ; port USB30_2_SSTXN
USB30_2_SSTXP: U1.174(PCIE1-TX0P) ; port USB30_2_SSTXP
USB-DET: U1.87(GPIO00) ; port USB-DET
USB_HOST_PWREN_H: R95059.2 U1.211(GPIO09) ; port USB_HOST_PWREN_H
VIN: U1.252(252VIN) U1.254(254VIN) U1.256(256VIN) U1.258(258VIN) U1.260(260VIN)
WIFI_REG_ON_H: U1.215(CAM-I2C-SDA) ; port WIFI_REG_ON_H
WIFI_WAKE_HOST_H: U1.216(GPIO11) U8.C3(A3) ; port WIFI_WAKE_HOST_H
NetD1_1: D1.1(A) J2.1
NetD5001_1: D5001.1(A) Q9518.3(DRAIN) U90087.1
NetQ9518_1: Q9518.1(GATE) R95059.1
NetQ9518_2: Q9518.2(SOURCE) R95060.1

Not connected (* = marked no-connect by the designer): J2 3 4; TP85 1(TP); TP87 1(TP); TP88 1(TP); TP90 1(TP); TP92 1(TP); TP93 1(TP); U1 21(CSI3-D0N) 23(CSI3-D0P) 27(CSI3-CLKN) 29(CSI3-CLKP) 33(CSI3-D1N) 35(CSI3-D1P) 122(CAM1-MCLK) h1 h2; U6 C1(B3)

## Notes on the sheet
- SODIMM
- FAN
- I2C0
- (near J2) BAT

## Library data of the parts
C2-C6 C10 = CAPACITOR_0: PAGE: 1
C7 C9 = CAP NP_2: cap,10.00uF,+/-10%,10V,X5R,C0805; Manufacturer: TDK; RK PN: C2012X5R1A106K125AB; Priority: A; Tolerance: 10%; Dielectric: X5R; Voltage: 10V; Part Type: C0805; Manufacturer PN: C2012X5R1A106K125AB; Created by: JJJ
C8 = CAP NP_2: cap,10.00uF,+/-10%,10V,X5R,C0805; Manufacturer PN: C2012X5R1A106K125AB; Manufacturer: TDK; Tolerance: 10%; Priority: A; Dielectric: X5R; Voltage: 10V; Created by: JJJ; Part Type: C0805; RK PN: C2012X5R1A106K125AB
C90418 = CAP NP: cap,100.00nF,+/-10%,16V,X5R,C0402; Manufacturer: TDK; RK PN: C1005X5R1C104K050BA; Priority: A; Tolerance: 10%; Voltage: 16V; Dielectric: X5R; Part Type: C0402; Manufacturer PN: C1005X5R1C104K050BA; Created by: JJJ
C90419 = CAP NP: cap,100.00nF,+/-10%,16V,X5R,C0402; Manufacturer PN: C1005X5R1C104K050BA; Manufacturer: TDK; Tolerance: 10%; Priority: A; Voltage: 16V; Dielectric: X5R; Created by: JJJ; Part Type: C0402; RK PN: C1005X5R1C104K050BA
C90427 = CAP NP: cap,10.00uF,+/-10%,25V,X5R,C1206; Manufacturer PN: C3216X5R1E106K085AC; Manufacturer: TDK; Tolerance: 10%; C_Voltage: 6.3V; Priority: A; Voltage: 25V; Dielectric: X5R; Created by: JJJ; Part Type: C1206; RK PN: C3216X5R1E106K085AC
C90428 = CAP NP: cap,100.00nF,+/-10%,25V,X5R,C0402; Manufacturer: TDK; RK PN: C1005X5R1E104K050BC; Priority: A; Tolerance: 10%; Voltage: 25V; Dielectric: X5R; Part Type: C0402; Manufacturer PN: C1005X5R1E104K050BC; Created by: JJJ
CON1 = CN_4
D1 = DIODE: Schottky Barrier，B5819W SOD-123; Manufacturer: 长电; ROOM: CHG; Priority: A; RK PN: B5819W; Part Type: Schottky rectifier; Manufacturer PN: B5819W; Created by: JJJ
D5001 = DIODE_Dup2: Schottky Barrier，B5819WS SOD-323; Manufacturer: 长电; Priority: A; Created by: JJJ; Manufacturer PN: B5819WS; Part Type: Schottky rectifier; RK PN: B5819WS
Q9518 = MOSFET N: MOSFET-N,WNM3003 ,30V,+/-20V,4.0A,33m Ohm@Vgs=10V,43m Ohm@Vgs=4.5V,SOT23
R5-R9 = R_2
R95059 = RESISTOR: 通用厚膜电阻,49K9,+/-1%,R0402,1/16W.; Manufacturer: YAGEO; Tolerance: 1%; RK PN: RC0402FR-0749K9L; Priority: A; Wattage: 1/16W; Part Type: 通用厚膜电阻; Manufacturer PN: RC0402FR-0749K9L; Created by: YTL
R95060 = RESISTOR: 通用厚膜电阻,10K,+/-5%,R0402,1/16W.; Manufacturer: YAGEO; Tolerance: 5%; RK PN: RC0402JR-0710KL; Priority: A; Wattage: 1/16W; Part Type: 通用厚膜电阻; Manufacturer PN: RC0402JR-0710KL; Created by: YTL
TP85 TP87 TP88 TP90 TP92 TP93 = Test Point: MISC, Test Point, Test Point, SMD, TP30C_SMD; Company Part Status: Grove Base Cape for PocketBeagle; ASSY: DNP; CLASS: DISCRETE; PN: TP30C_SMD; Package Size: TP30C_SMD
U1 = DDR4SODIMM_1
U3-U8 = MP2610_0: 4-bit Bi-directional Level Shifter UM3204H; Part Number: PI4ULS5V104GAEX; Vendor: PERICOM
U90087 = CON3_6